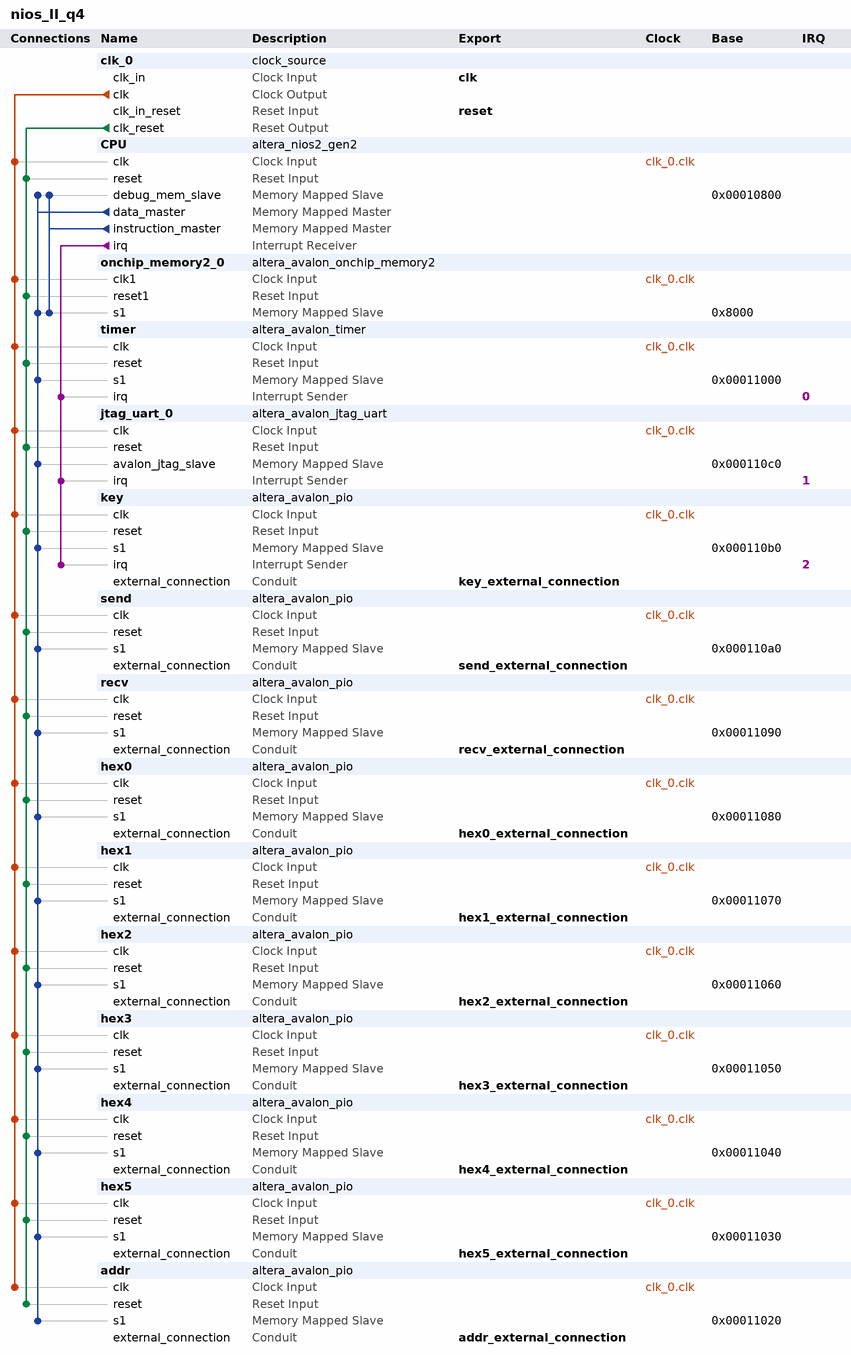
[diagram p0: system contents]
# Platform Designer (Qsys) system nios_II_q4, Cyclone V 5CSEMA5F31C6
# Parameters at their usual value, and those the tool derives, are not listed.
package require -exact qsys 18.1
create_system nios_II_q4
set_project_property DEVICE_FAMILY {Cyclone V}
set_project_property DEVICE 5CSEMA5F31C6

add_instance clk_0 clock_source 18.1
set_instance_parameter_value clk_0 clockFrequency 50000000

add_instance CPU altera_nios2_gen2 18.1
set_instance_parameter_value CPU cpuID 1
set_instance_parameter_value CPU dcache_size 2048
set_instance_parameter_value CPU exceptionSlave onchip_memory2_0.s1
set_instance_parameter_value CPU icache_size 4096
set_instance_parameter_value CPU impl Fast
set_instance_parameter_value CPU resetSlave onchip_memory2_0.s1

add_instance onchip_memory2_0 altera_avalon_onchip_memory2 18.1
set_instance_parameter_value onchip_memory2_0 dataWidth 32
set_instance_parameter_value onchip_memory2_0 dualPort false
set_instance_parameter_value onchip_memory2_0 initMemContent true
set_instance_parameter_value onchip_memory2_0 initializationFileName onchip_mem.hex
set_instance_parameter_value onchip_memory2_0 memorySize 20480

add_instance timer altera_avalon_timer 18.1
set_instance_parameter_value timer period 1
set_instance_parameter_value timer periodUnits MSEC

add_instance jtag_uart_0 altera_avalon_jtag_uart 18.1
set_instance_parameter_value jtag_uart_0 simInteractiveOptions NO_INTERACTIVE_WINDOWS

add_instance key altera_avalon_pio 18.1
set_instance_parameter_value key captureEdge true
set_instance_parameter_value key direction Input
set_instance_parameter_value key generateIRQ true
set_instance_parameter_value key irqType EDGE
set_instance_parameter_value key width 4

add_instance send altera_avalon_pio 18.1
set_instance_parameter_value send direction Output
set_instance_parameter_value send width 32

add_instance recv altera_avalon_pio 18.1
set_instance_parameter_value recv direction Input
set_instance_parameter_value recv width 32

add_instance hex0 altera_avalon_pio 18.1
set_instance_parameter_value hex0 direction Output
set_instance_parameter_value hex0 width 7

add_instance hex1 altera_avalon_pio 18.1
set_instance_parameter_value hex1 direction Output
set_instance_parameter_value hex1 width 7

add_instance hex2 altera_avalon_pio 18.1
set_instance_parameter_value hex2 direction Output
set_instance_parameter_value hex2 width 7

add_instance hex3 altera_avalon_pio 18.1
set_instance_parameter_value hex3 direction Output
set_instance_parameter_value hex3 width 7

add_instance hex4 altera_avalon_pio 18.1
set_instance_parameter_value hex4 direction Output
set_instance_parameter_value hex4 width 7

add_instance hex5 altera_avalon_pio 18.1
set_instance_parameter_value hex5 direction Output
set_instance_parameter_value hex5 width 7

add_instance addr altera_avalon_pio 18.1
set_instance_parameter_value addr direction Output
set_instance_parameter_value addr width 8

# connections
add_connection clk_0.clk addr.clk clock
add_connection clk_0.clk CPU.clk clock
add_connection clk_0.clk hex0.clk clock
add_connection clk_0.clk hex1.clk clock
add_connection clk_0.clk hex2.clk clock
add_connection clk_0.clk hex3.clk clock
add_connection clk_0.clk hex4.clk clock
add_connection clk_0.clk hex5.clk clock
add_connection clk_0.clk jtag_uart_0.clk clock
add_connection clk_0.clk key.clk clock
add_connection clk_0.clk onchip_memory2_0.clk1 clock
add_connection clk_0.clk recv.clk clock
add_connection clk_0.clk send.clk clock
add_connection clk_0.clk timer.clk clock
add_connection clk_0.clk_reset addr.reset reset
add_connection clk_0.clk_reset CPU.reset reset
add_connection clk_0.clk_reset hex0.reset reset
add_connection clk_0.clk_reset hex1.reset reset
add_connection clk_0.clk_reset hex2.reset reset
add_connection clk_0.clk_reset hex3.reset reset
add_connection clk_0.clk_reset hex4.reset reset
add_connection clk_0.clk_reset hex5.reset reset
add_connection clk_0.clk_reset jtag_uart_0.reset reset
add_connection clk_0.clk_reset key.reset reset
add_connection clk_0.clk_reset onchip_memory2_0.reset1 reset
add_connection clk_0.clk_reset recv.reset reset
add_connection clk_0.clk_reset send.reset reset
add_connection clk_0.clk_reset timer.reset reset
add_connection CPU.data_master addr.s1 avalon
set_connection_parameter_value CPU.data_master/addr.s1 baseAddress 0x00011020
add_connection CPU.data_master CPU.debug_mem_slave avalon
set_connection_parameter_value CPU.data_master/CPU.debug_mem_slave baseAddress 0x00010800
add_connection CPU.data_master hex0.s1 avalon
set_connection_parameter_value CPU.data_master/hex0.s1 baseAddress 0x00011080
add_connection CPU.data_master hex1.s1 avalon
set_connection_parameter_value CPU.data_master/hex1.s1 baseAddress 0x00011070
add_connection CPU.data_master hex2.s1 avalon
set_connection_parameter_value CPU.data_master/hex2.s1 baseAddress 0x00011060
add_connection CPU.data_master hex3.s1 avalon
set_connection_parameter_value CPU.data_master/hex3.s1 baseAddress 0x00011050
add_connection CPU.data_master hex4.s1 avalon
set_connection_parameter_value CPU.data_master/hex4.s1 baseAddress 0x00011040
add_connection CPU.data_master hex5.s1 avalon
set_connection_parameter_value CPU.data_master/hex5.s1 baseAddress 0x00011030
add_connection CPU.data_master jtag_uart_0.avalon_jtag_slave avalon
set_connection_parameter_value CPU.data_master/jtag_uart_0.avalon_jtag_slave baseAddress 0x000110c0
add_connection CPU.data_master key.s1 avalon
set_connection_parameter_value CPU.data_master/key.s1 baseAddress 0x000110b0
add_connection CPU.data_master onchip_memory2_0.s1 avalon
set_connection_parameter_value CPU.data_master/onchip_memory2_0.s1 baseAddress 0x8000
add_connection CPU.data_master recv.s1 avalon
set_connection_parameter_value CPU.data_master/recv.s1 baseAddress 0x00011090
add_connection CPU.data_master send.s1 avalon
set_connection_parameter_value CPU.data_master/send.s1 baseAddress 0x000110a0
add_connection CPU.data_master timer.s1 avalon
set_connection_parameter_value CPU.data_master/timer.s1 baseAddress 0x00011000
add_connection CPU.instruction_master CPU.debug_mem_slave avalon
set_connection_parameter_value CPU.instruction_master/CPU.debug_mem_slave baseAddress 0x00010800
add_connection CPU.instruction_master onchip_memory2_0.s1 avalon
set_connection_parameter_value CPU.instruction_master/onchip_memory2_0.s1 baseAddress 0x8000
add_connection CPU.irq jtag_uart_0.irq interrupt
set_connection_parameter_value CPU.irq/jtag_uart_0.irq irqNumber 1
add_connection CPU.irq key.irq interrupt
set_connection_parameter_value CPU.irq/key.irq irqNumber 2
add_connection CPU.irq timer.irq interrupt
set_connection_parameter_value CPU.irq/timer.irq irqNumber 0

# exported interfaces
add_interface addr_external_connection conduit end
set_interface_property addr_external_connection EXPORT_OF addr.external_connection
add_interface clk clock sink
set_interface_property clk EXPORT_OF clk_0.clk_in
add_interface hex0_external_connection conduit end
set_interface_property hex0_external_connection EXPORT_OF hex0.external_connection
add_interface hex1_external_connection conduit end
set_interface_property hex1_external_connection EXPORT_OF hex1.external_connection
add_interface hex2_external_connection conduit end
set_interface_property hex2_external_connection EXPORT_OF hex2.external_connection
add_interface hex3_external_connection conduit end
set_interface_property hex3_external_connection EXPORT_OF hex3.external_connection
add_interface hex4_external_connection conduit end
set_interface_property hex4_external_connection EXPORT_OF hex4.external_connection
add_interface hex5_external_connection conduit end
set_interface_property hex5_external_connection EXPORT_OF hex5.external_connection
add_interface key_external_connection conduit end
set_interface_property key_external_connection EXPORT_OF key.external_connection
add_interface recv_external_connection conduit end
set_interface_property recv_external_connection EXPORT_OF recv.external_connection
add_interface reset reset sink
set_interface_property reset EXPORT_OF clk_0.clk_in_reset
add_interface send_external_connection conduit end
set_interface_property send_external_connection EXPORT_OF send.external_connection

set_interconnect_requirement {$system} qsys_mm.clockCrossingAdapter HANDSHAKE
set_interconnect_requirement {$system} qsys_mm.enableEccProtection FALSE
set_interconnect_requirement {$system} qsys_mm.insertDefaultSlave FALSE
set_interconnect_requirement {$system} qsys_mm.maxAdditionalLatency 1

save_system nios_II_q4.qsys
